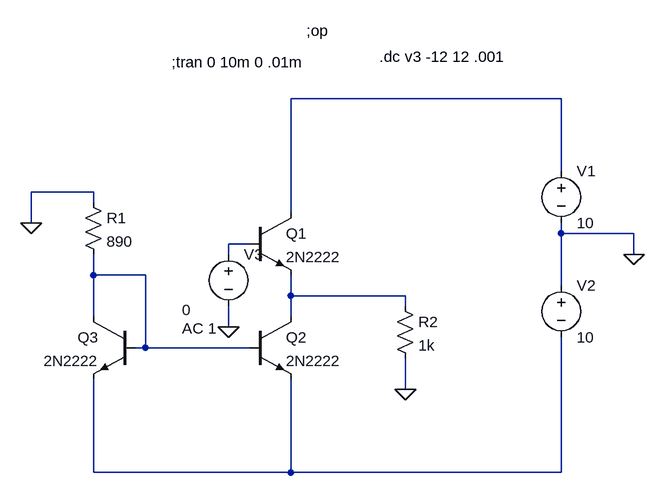
[diagram p0: schematic salida pot clasa A.asc]
salida pot clasa A.asc, the LTspice schematic file:
Version 4
SHEET 1 880 680
WIRE 656 -112 240 -112
WIRE 656 0 656 -112
WIRE -64 32 -160 32
WIRE -64 48 -64 32
WIRE 240 64 240 -112
WIRE -160 80 -160 32
WIRE 656 96 656 80
WIRE 768 96 656 96
WIRE 176 112 144 112
WIRE 144 128 144 112
WIRE 768 128 768 96
WIRE -64 160 -64 128
WIRE 16 160 -64 160
WIRE 656 176 656 96
WIRE 240 192 240 160
WIRE 320 192 240 192
WIRE 416 192 320 192
WIRE 416 208 416 192
WIRE -64 224 -64 160
WIRE 240 224 240 192
WIRE 144 240 144 208
WIRE 16 272 16 160
WIRE 16 272 0 272
WIRE 176 272 16 272
WIRE 416 336 416 288
WIRE -64 464 -64 320
WIRE 240 464 240 320
WIRE 240 464 -64 464
WIRE 656 464 656 256
WIRE 656 464 240 464
FLAG 768 128 0
FLAG -160 80 0
FLAG 416 336 0
FLAG 144 240 0
DATAFLAG 320 192 ""
SYMBOL npn 176 64 R0
SYMATTR InstName Q1
SYMATTR Value 2N2222
SYMBOL npn 176 224 R0
SYMATTR InstName Q2
SYMATTR Value 2N2222
SYMBOL npn 0 224 M0
SYMATTR InstName Q3
SYMATTR Value 2N2222
SYMBOL voltage 656 -16 R0
WINDOW 123 0 0 Left 2
WINDOW 39 0 0 Left 2
SYMATTR InstName V1
SYMATTR Value 10
SYMBOL voltage 656 160 R0
WINDOW 123 0 0 Left 2
WINDOW 39 0 0 Left 2
SYMATTR InstName V2
SYMATTR Value 10
SYMBOL res -80 32 R0
SYMATTR InstName R1
SYMATTR Value 890
SYMBOL res 400 192 R0
SYMATTR InstName R2
SYMATTR Value 1k
SYMBOL voltage 144 112 R0
WINDOW 3 -72 102 Left 2
WINDOW 123 -72 130 Left 2
WINDOW 39 0 0 Left 2
SYMATTR InstName V3
SYMATTR Value 0
SYMATTR Value2 AC 1
TEXT 264 -216 Left 2 !;op
TEXT 56 -168 Left 2 !;tran 0 10m 0 .01m
TEXT 376 -176 Left 2 !.dc v3 -12 12 .001

The netlist it stands for:
* salida pot clasa A.asc
Q1 N001 N002 N004 0 2N2222
Q2 N004 N003 N005 0 2N2222
Q3 N003 N003 N005 0 2N2222
V1 N001 0 10
V2 0 N005 10
R1 0 N003 890
R2 N004 0 1k
V3 N002 0 0 AC 1
.model NPN NPN
.model PNP PNP
.lib standard.bjt
;op
;tran 0 10m 0 .01m
.dc v3 -12 12 .001
.backanno
.end